# Altium project Temperature_controller.PrjPcb
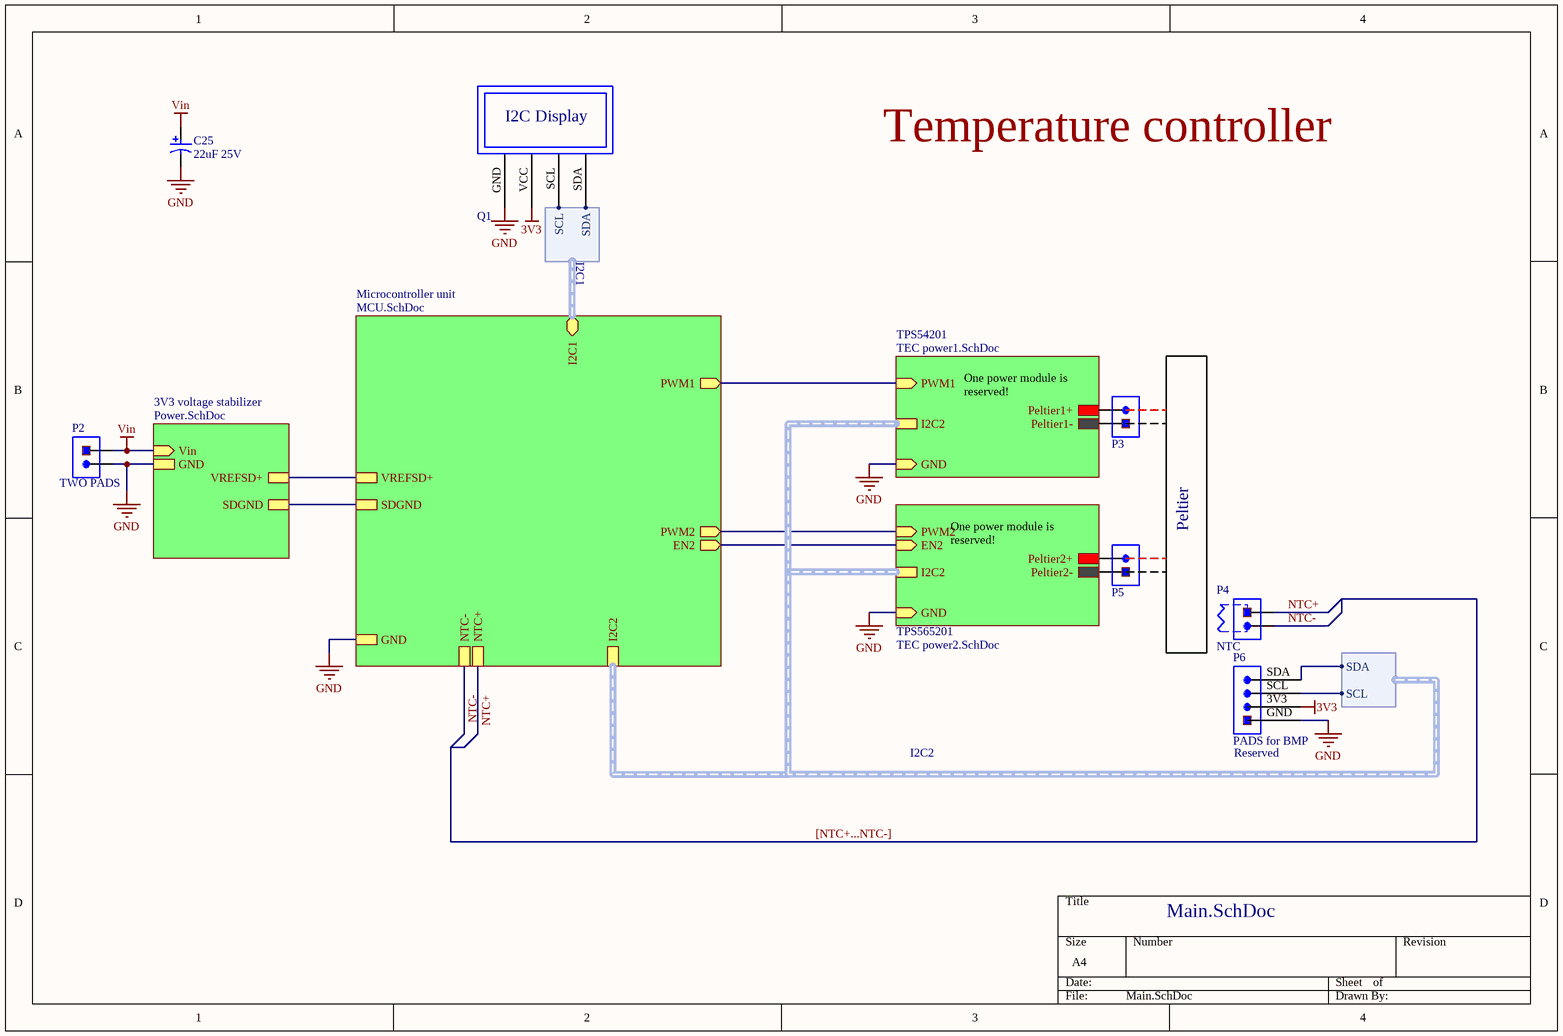
[diagram p0: Main.SchDoc]
5 sheets, 94 parts. Net scope: hierarchical (ports join the sheet entries above them; power ports are global).
Board file: temperature_controller.PcbDoc
Sheets:
  Main.SchDoc
    3V3 voltage stabilizer = Power.SchDoc
    Microcontroller unit = MCU.SchDoc
    TPS54201 = TEC power1.SchDoc
    TPS565201 = TEC power2.SchDoc

## Sheet Main.SchDoc
size A4

### Parts
C25  22uF 25V  [PNSC-FP-V-C_V]
P2  TWO PADS  [TWO PADS - medium]
P3  TWO PADS for TEC  [TWO PADS]  (value not drawn)
P4  NTC  [TWO PADS]
P5  TWO PADS for TEC  [TWO PADS]  (value not drawn)
P6  PADS for BMP  [FOUR PADS]
Q1  SSD1306 OLED_big  [SSD1306 OLED]  (value not drawn)

### Sub-sheets
3V3 voltage stabilizer = Power.SchDoc: Vin (in), VREFSD+, SDGND, GND
Microcontroller unit = MCU.SchDoc: I2C1 (bidir, harness I2C1), PWM1 (out), NTC+, NTC-, SDGND, VREFSD+, GND, I2C2 (harness I2C2), PWM2 (out), EN2 (out)
TPS54201 = TEC power1.SchDoc: PWM1 (in), Peltier1+, Peltier1-, GND (in), I2C2 (harness I2C2)
TPS565201 = TEC power2.SchDoc: PWM2 (in), EN2 (in), Peltier2+, Peltier2-, GND (in), I2C2 (harness I2C2)

### Harnesses
I2C1: SCL, SDA
I2C2: SDA, SCL

### Nets
3V3: P6.3V3 Q1.VCC
ADC_RES+: sheet 3V3 voltage stabilizer/VREFSD+, sheet Microcontroller unit/VREFSD+
GND: C25.2 P2.1 P5.2 P6.GND Q1.GND ; sheet 3V3 voltage stabilizer/GND, sheet Microcontroller unit/GND, sheet TPS54201/GND, sheet TPS565201/Peltier2-, sheet TPS565201/GND
NTC-: P4.1 ; sheet 3V3 voltage stabilizer/SDGND, sheet Microcontroller unit/NTC-, sheet Microcontroller unit/SDGND
Vin: C25.1 P2.2 ; sheet 3V3 voltage stabilizer/Vin
NTC+: P4.2 ; sheet Microcontroller unit/NTC+
TEC1_shunt-: P3.1 ; sheet TPS54201/Peltier1+
TEC2_shunt-: P5.1 ; sheet TPS565201/Peltier2+
NetC30_2: P3.2 ; sheet TPS54201/Peltier1-
NetIC1_5: sheet Microcontroller unit/PWM1, sheet TPS54201/PWM1
NetIC2_4: P6.SDA ; sheet Microcontroller unit/I2C2.SDA
NetIC2_5: P6.SCL ; sheet Microcontroller unit/I2C2.SCL
NetIC3_5: sheet Microcontroller unit/EN2, sheet TPS565201/EN2
NetQ1_SCL: Q1.SCL ; sheet Microcontroller unit/I2C1.SCL
NetQ1_SDA: Q1.SDA ; sheet Microcontroller unit/I2C1.SDA
NetR28_2: sheet Microcontroller unit/PWM2, sheet TPS565201/PWM2

### Buses and harness runs
bus [NTC+...NTC-]
harness sheet Microcontroller unit/I2C2 = sheet TPS54201/I2C2 = sheet TPS565201/I2C2

### Notes on the sheet
- Temperature controller
- One power module is reserved!
- Peltier
- (near P6) Reserved
- (in symbol SSD1306 OLED_big) I2C Display

### Library data of the parts
C25 = CMP-2000-06213-1: Aluminum Electrolytic Capacitor, 22 uF, +/- 20%, 25 V, 2-Pin SMD (Size Code C), -55 to 105 degC, RoHS, Tape and Reel; Manufacturer: Panasonic; ESR (Equivalent Series Resistance): 0.36O; Ripple Current: 240mA; Capacitance: 22µF; Lifetime@Temperature: 2000Hrs@105°C; Type: Can; Package Reference: FP-V-C; Package Description: 2-Pin Electrolytic Aluminum Capacitor, Body 5.3 x 5.3 mm; Operating Temp Range: -55to+105°C; Mounting Technology: SurfaceMount; Datasheet URL: http://industrial.panasonic.com/cdbs/www-data/pdf/RDE0000/ABA0000C1184.pdf; Case Size/Dimension: Ø5x5.8mm; Operating Temp-Max: 105°C; Package URL: http://industrial.panasonic.com/cdbs/www-data/pdf/RDE0000/DME0000COL48.pdf; Rated Voltage: 25V; Datasheet Version: 03/2016; Series: FP; Manufacturer URL: http://www.panasonic.com/; Value: 22uF; Voltage: 25V; LCSC Part #: C249771
P2 = TWO PADS: Value: 1uF
P3 P5 = TWO PADS for TEC: Value: 1uF
P4 = TWO PADS for NTC: Value: 1uF
P6 = PADS for BMP: Value: 1uF
Q1 = SSD1306 OLED_big: I2C display

## Sheet Power.SchDoc
size A4
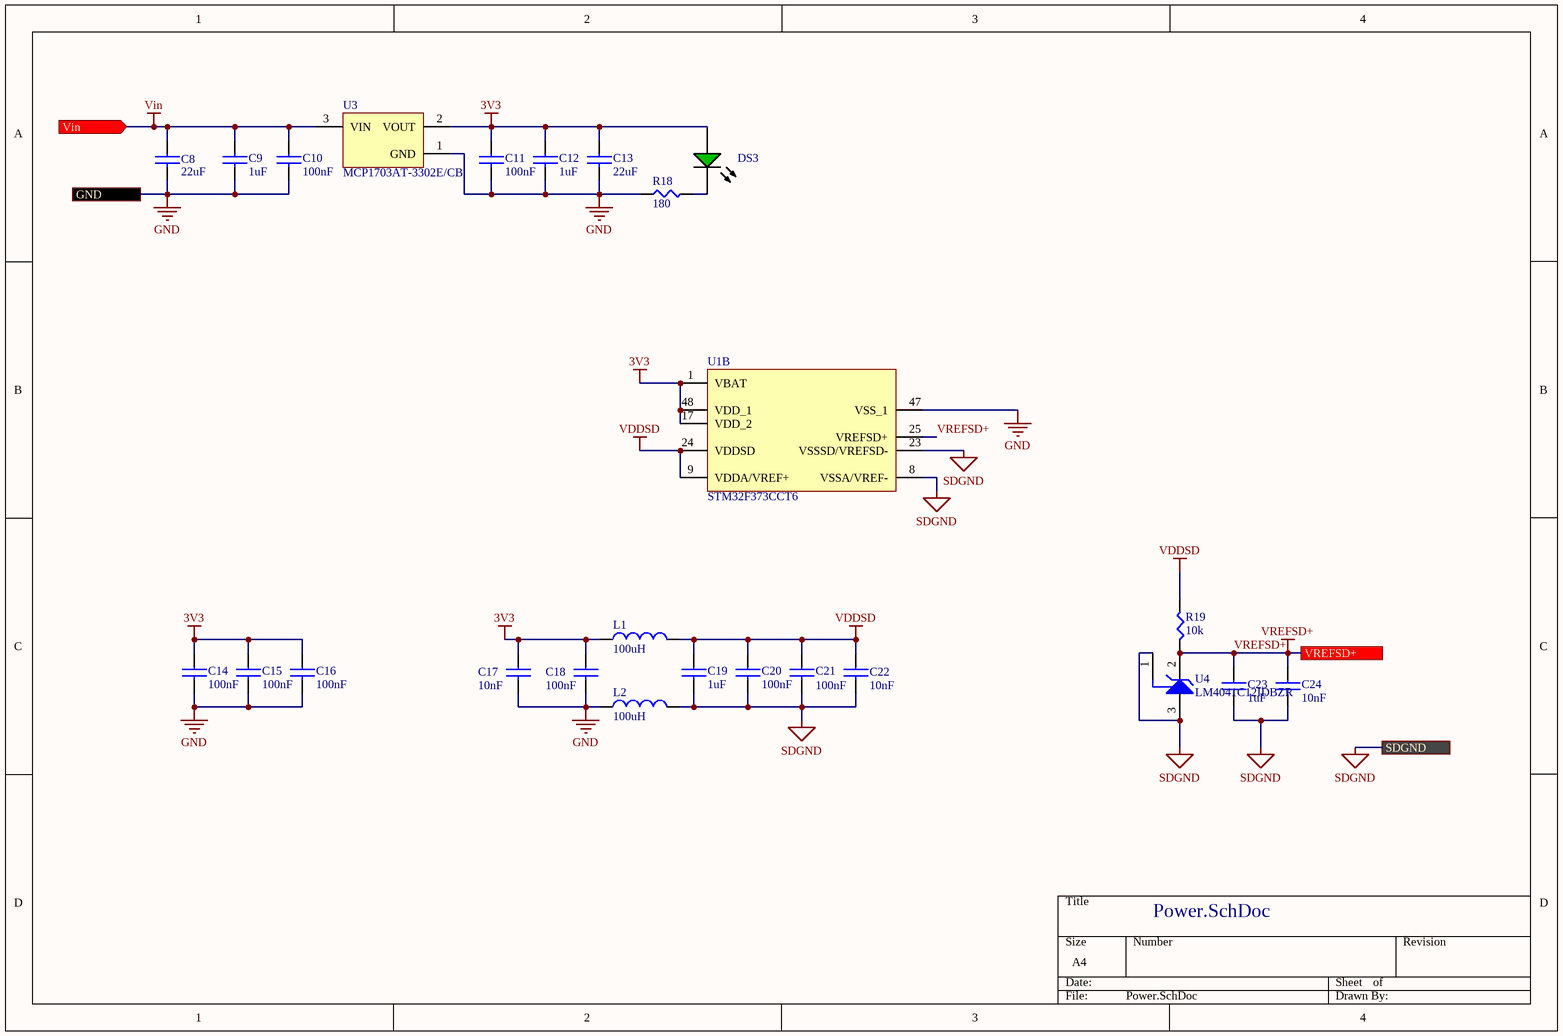
[diagram p1: Power.SchDoc]

### Parts
C8  22uF  [CAPC200X125X110L50N]
C9  1uF  [CAPC160X80X90L35N]
C10  100nF  [CAPC160X80X90L35N]
C11  100nF  [CAPC160X80X90L35N]
C12  1uF  [CAPC160X80X90L35N]
C13  22uF  [CAPC200X125X110L50N]
C14  100nF  [CAPC160X80X90L35N]
C15  100nF  [CAPC160X80X90L35N]
C16  100nF  [CAPC160X80X90L35N]
C17  10nF  [CAPC160X80X90L35N]
C18  100nF  [CAPC160X80X90L35N]
C19  1uF  [CAPC160X80X90L35N]
C20  100nF  [CAPC160X80X90L35N]
C21  100nF  [CAPC160X80X90L35N]
C22  10nF  [CAPC160X80X90L35N]
C23  1uF  [CAPC160X80X90L35N]
C24  10nF  [CAPC160X80X90L35N]
DS3  19-217/GHC-YR1S2/3T  [LEDC160X80X60L30N]  (value not drawn)
L1  100uH  [INDM320X250X240L55X190N]
L2  100uH  [INDM320X250X240L55X190N]
R18  180  [RESC160X80X90L30N]
R19  10k  [RESC160X80X90L30N]
U1  STM32F373CCT6  [STM-LQFP48_L]  (part B of 2)
U3  MCP1703AT-3302E/CB  [SOT-23A-CB3_M]
U4  LM4041C12IDBZR  [SOT-23A-CB3_M]

### Ports
GND, SDGND, Vin (in), VREFSD+

### Nets
3V3: C11.1 C12.1 C13.1 C14.1 C15.1 C16.1 C17.1 C18.1 DS3.A L1.1 U1.1(VBAT) U1.17(VDD_2) U1.48(VDD_1) U3.2(VOUT)
GND: C8.2 C9.2 C10.2 C11.2 C12.2 C13.2 C14.2 C15.2 C16.2 C17.2 C18.2 L2.1 R18.1 U1.47(VSS_1) U3.1(GND) ; port GND
SDGND: C19.2 C20.2 C21.2 C22.2 C23.2 C24.2 L2.2 U1.8(VSSA/VREF-) U1.23(VSSSD/VREFSD-) U4.1(CATHODE) U4.3(NC) ; port SDGND  [project net NTC-]
VDDSD: C19.1 C20.1 C21.1 C22.1 L1.2 R19.2 U1.9(VDDA/VREF+) U1.24(VDDSD)
Vin: C8.1 C9.1 C10.1 U3.3(VIN) ; port Vin
VREFSD+: C23.1 C24.1 R19.1 U1.25(VREFSD+) U4.2(ANODE) ; port VREFSD+  [project net ADC_RES+]
NetDS3_C: DS3.C R18.2

### Library data of the parts
C8 C13 = capacitor: Part Number: CL21A226MAQNNNE; Value: 22uF; LCSC Part #: C45783
C9 C12 C19 C23 = capacitor: Part Number: CL10A105KB8NNNC; Value: 1uF; LCSC Part #: C15849
C10 C11 C14-C16 C18 C20 C21 = capacitor: Part Number: CC0603KRX7R9BB104; Value: 100nF; LCSC Part #: C14663
C17 C22 C24 = capacitor: Part Number: 0603B103K500NT; Value: 10nF; LCSC Part #: C57112
DS3 = LED: Green LED; Part Number: 19-217/GHC-YR1S2/3T; LCSC Part #: C72043
L1 L2 = Inductor: Part Number: NLV32T-101J-PF; Value: 100uH; Resistance: *; Package: *; LCSC Part #: C76836
R18 = Resistor: Part Number: 0603WAF1800T5E; Value: 180; LCSC Part #: C22828
R19 = Resistor: Part Number: 0603WAF1002T5E; Value: 10k; LCSC Part #: C25804
U1 = STM32F373CCT6: ARM Cortex-M4 32-bit MCU, 256 KB Flash, 32 KB Internal RAM, 36 I/Os, 48-pin LQFP, -40 to 85 degC, Tray; Manufacturer: STMicroelectronics; FLASH Size (Prog) (kB): 256; Internal RAM Size (kB): 32; Operating Frequency(F) (Processor speed) (MHz): 72; I/Os (High Current): 36; Supply Voltage(Vcc) min (V): 2; Mounting Technology: Surface Mount; ComponentLink2Description: Datasheet; PackageReference: LQFP48; Packing: Tray; PackageVersion: Rev. 6, 06/2013; ComponentLink1Description: Manufacturer URL; ComponentLink3Description: Package Specification; ComponentLink2URL: http://www.st.com/st-web-ui/static/active/en/resource/technical/document/datasheet/DM00046749.pdf; PartNumber: STM32F373CCT6; Core: ARM Cortex-M4; ComponentLink1URL: http://www.st.com/web/en/home.html; ComponentLink3URL: http://www.st.com/st-web-ui/static/active/en/resource/technical/document/datasheet/DM00058181.pdf; DatasheetVersion: Rev. 3; PackageDescription: 48-Pin Low Profile Quad Flat Package, 7 x 7 mm Body, 0.5 mm Pitch; LCSC Part #: C89403; Manufacturer Part Number: STM32F373CCT6
U3 = CMP-0136-00758-1: PackageReference: SOT-23A-CB3; PackageVersion: revBB, Aug-2009; DatasheetVersion: revD, Sep-2009; PackageDescription: 3-Lead Plastic Small Outline Transistor (CB) [SOT-23A]; Part Number: MCP1703; LCSC Part #: C144183
U4 = LMZ4041C12IDBZR: Precision Micropower Shunt Voltage Reference, 0.5% accuracy, 1.2 V, 15 ppm / degC, 12 mA, -40 to 85 degC, 3-pin SOT-23 (DBZ), Green (RoHS & no Sb/Br); Manufacturer: Texas Instruments; Rating: Catalog; Temp Coeff(Max)(ppm/ degree C): 100; Min Iz for Regulation(uA): 60; Iout/Iz(Max)(mA): 12; Temp Coeff(Typ)(ppm/ degree C): 15; Initial Accuracy @ 25/deg C(%): 0.5; VO(V): 1.225; ComponentLink3URL: http://www.ti.com/litv/pdf/mpds108a; Code_JEDEC: TO-236; PackageVersion: 4203227/B; SubFamily: Shunt Voltage Reference; ComponentLink4Description: URL Link1; ComponentLink4URL: Samples URL:http://www.ti.com/product/lm4041c12; Mounting Technology: Surface Mount; ComponentLink1URL: http://www.ti.com/; ComponentLink2URL: http://www.ti.com/general/docs/lit/getliterature.tsp?genericPartNumber=LM4041C12&fileType=pdf; Eco-Plan: Green (RoHS & no Sb/Br); PackageReference: DBZ0003A; PackageDescription: 3-Pin Plastic Small Outline, Body 2.92 x 1.3 mm, Pitch 0.95 mm; PartNumber: LM4041C12IDBZR; DatasheetVersion: SLCS146E; ComponentLink2Description: Datasheet; ComponentLink1Description: Manufacturer URL; ComponentLink3Description: Package Specification; LCSC Part #: C133587

## Sheet MCU.SchDoc
size A4
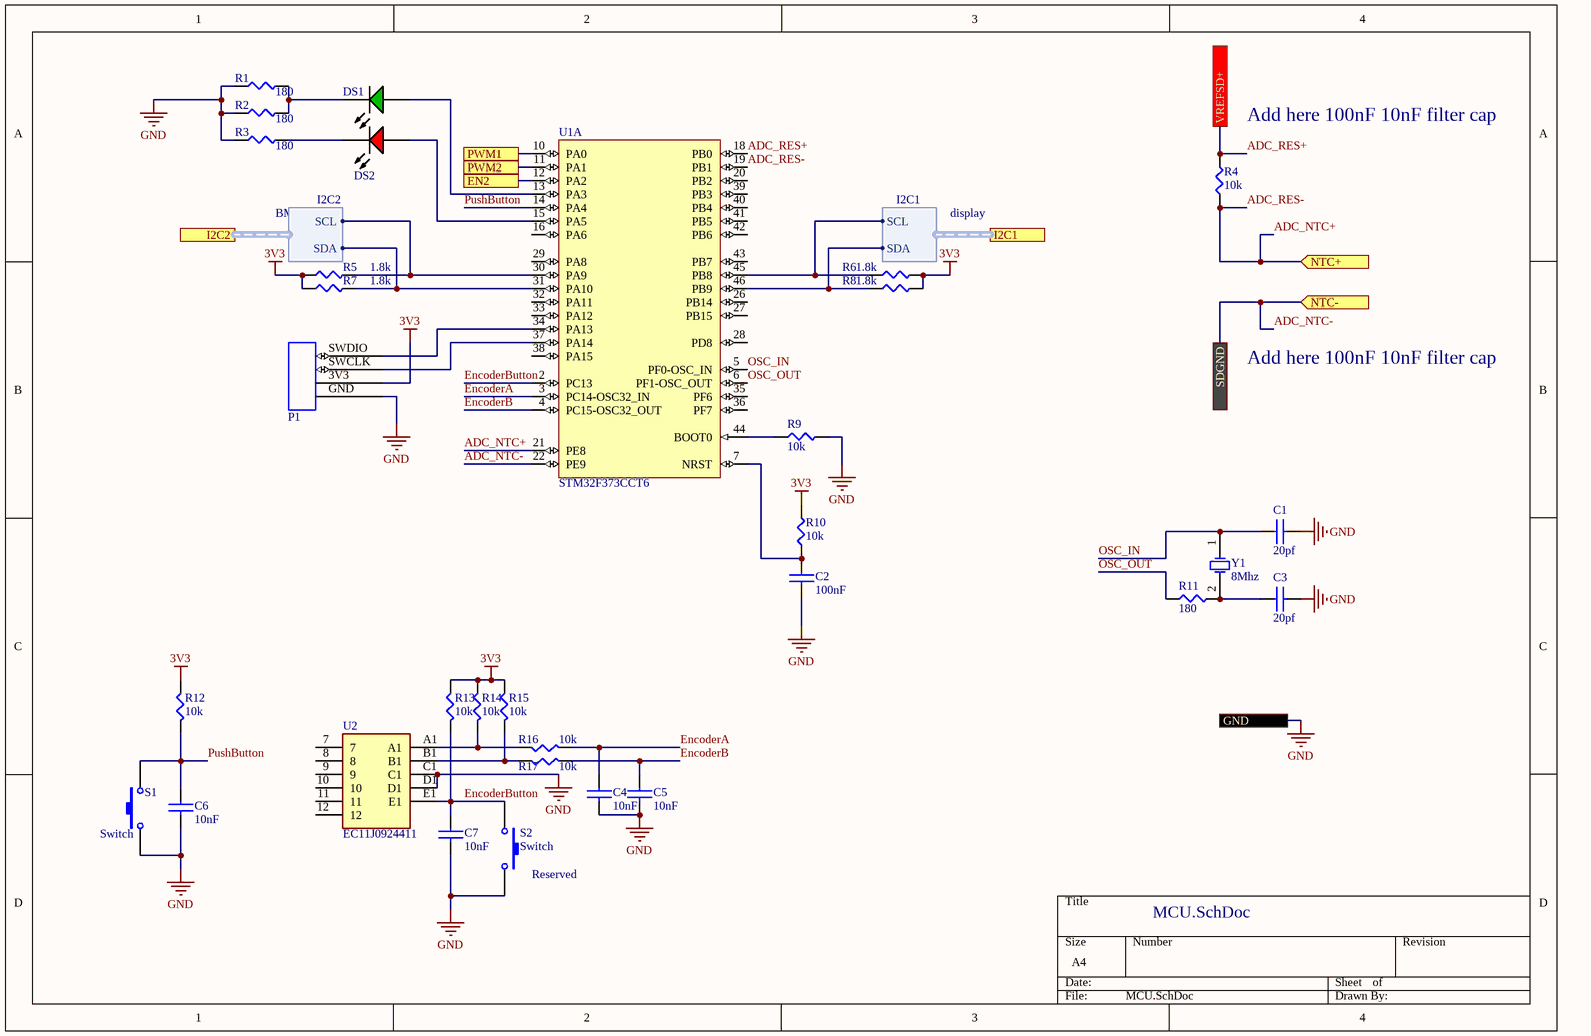
[diagram p2: MCU.SchDoc]

### Parts
C1  20pf  [CAPC160X80X90L35N]
C2  100nF  [CAPC160X80X90L35N]
C3  20pf  [CAPC160X80X90L35N]
C4  10nF  [CAPC160X80X90L35N]
C5  10nF  [CAPC160X80X90L35N]
C6  10nF  [CAPC160X80X90L35N]
C7  10nF  [CAPC160X80X90L35N]
DS1  19-217/GHC-YR1S2/3T  [LEDC160X80X60L30N]  (value not drawn)
DS2  FC-2012HRK-620D  [LEDC200X125X110L30N]  (value not drawn)
P1  SWD  [SWD]  (value not drawn)
R1  180  [RESC160X80X90L30N]
R2  180  [RESC160X80X90L30N]
R3  180  [RESC160X80X90L30N]
R4  10k  [RESC160X80X90L30N]
R5  1.8k  [RESC160X80X90L30N]
R6  1.8k  [RESC160X80X90L30N]
R7  1.8k  [RESC160X80X90L30N]
R8  1.8k  [RESC160X80X90L30N]
R9  10k  [RESC160X80X90L30N]
R10  10k  [RESC160X80X90L30N]
R11  180  [RESC160X80X90L30N]
R12  10k  [RESC160X80X90L30N]
R13  10k  [RESC160X80X90L30N]
R14  10k  [RESC160X80X90L30N]
R15  10k  [RESC160X80X90L30N]
R16  10k  [RESC160X80X90L30N]
R17  10k  [RESC160X80X90L30N]
S1  Switch  [Tactile switch]
S2  Switch  [Tactile switch]
U1  STM32F373CCT6  [STM-LQFP48_L]  (part A of 2)
U2  EC11J0924411  [EC11J0924411]
Y1  8Mhz  [5032]

### Ports
EN2, GND, I2C1 (harness I2C1), I2C2 (harness I2C2), NTC+ (in), NTC- (in), PWM1, PWM2, SDGND, VREFSD+

### Harnesses
I2C1: SCL, SDA
I2C2: SCL, SDA

### Nets
3V3: P1.3V3 R5.1 R6.2 R7.1 R8.2 R10.2 R12.1 R13.1 R14.1 R15.1
ADC_NTC-: U1.22(PE9) ; port NTC-, port SDGND  [project net NTC-]
ADC_RES+: R4.2 U1.18(PB0) ; port VREFSD+
GND: C1.2 C2.2 C3.2 C4.2 C5.2 C6.2 C7.2 P1.GND R1.1 R2.1 R3.1 R9.2 S1.1 S2.2 U2.C1 U2.D1 ; port GND
ADC_NTC+: R4.1 U1.19(PB1) U1.21(PE8) ; port NTC+  [also labelled ADC_RES-]  [project net NTC+]
EncoderA: C4.1 R16.2 U1.3(PC14-OSC32_IN)
EncoderB: C5.1 R17.2 U1.4(PC15-OSC32_OUT)
EncoderButton: C7.1 R13.2 S2.1 U1.2(PC13) U2.E1
OSC_IN: C1.1 U1.5(PF0-OSC_IN) Y1.1(OSC1)
OSC_OUT: R11.1 U1.6(PF1-OSC_OUT)
PushButton: C6.1 R12.2 S1.2 U1.14(PA4)
NetC2_1: C2.1 R10.1 U1.7(NRST)
NetC3_1: C3.1 R11.2 Y1.2(OSC2)
NetDS1_A: DS1.A U1.13(PA3)
NetDS1_C: DS1.C R1.2 R2.2
NetDS2_A: DS2.A U1.15(PA5)
NetDS2_C: DS2.C R3.2
NetIC1_5: U1.10(PA0) ; port PWM1
NetIC2_4: R7.2 U1.31(PA10) ; port I2C2.SDA
NetIC2_5: R5.2 U1.30(PA9) ; port I2C2.SCL
NetIC3_5: U1.12(PA2) ; port EN2
NetP1_SWCLK: P1.SWCLK U1.37(PA14)
NetP1_SWDIO: P1.SWDIO U1.34(PA13)
NetQ1_SCL: R6.1 U1.45(PB8) ; port I2C1.SCL
NetQ1_SDA: R8.1 U1.46(PB9) ; port I2C1.SDA
NetR9_1: R9.1 U1.44(BOOT0)
NetR14_2: R14.2 R16.1 U2.A1
NetR15_2: R15.2 R17.1 U2.B1
NetR28_2: U1.11(PA1) ; port PWM2

Not connected (* = marked no-connect by the designer): U1 16(PA6) 20(PB2) 26(PB14) 27(PB15) 28(PD8) 29(PA8) 32(PA11) 33(PA12) 35(PF6) 36(PF7) 38(PA15) 39(PB3) 40(PB4) 41(PB5) 42(PB6) 43(PB7); U2 7 8 9 10 11 12

### Notes on the sheet
- (near R4) Add here 100nF 10nF filter cap
- BMP280
- display
- Add here 100nF 10nF filter cap
- (near S2) Reserved

### Library data of the parts
C1 C3 = capacitor: Part Number: CL10C200JB8NNNC; Value: 20pf; LCSC Part #: C1648
C2 = capacitor: Part Number: CC0603KRX7R9BB104; Value: 100nF; LCSC Part #: C14663
C4-C7 = capacitor: Part Number: 0603B103K500NT; Value: 10nF; LCSC Part #: C57112
DS1 = LED: Green LED; Part Number: 19-217/GHC-YR1S2/3T; LCSC Part #: C72043
DS2 = RED LED: Part Number: FC-2012HRK-620D; LCSC Part #: C84256; Package: 0805
P1 = SWD port
R1-R3 R11 = Resistor: Part Number: 0603WAF1800T5E; Value: 180; LCSC Part #: C22828
R4 R9 R10 R12-R17 = Resistor: Part Number: 0603WAF1002T5E; Value: 10k; LCSC Part #: C25804
R5-R8 = Resistor: Part Number: 0603WAF1801T5E; Value: 1.8k; LCSC Part #: C4177
S1 S2 = Switch: Part Number: TS-1187A-C-E-B; C57112: C318887; Published: 24-Mar-1999; LatestRevisionDate: 17-Jul-2002; LatestRevisionNote: Re-released for DXP Platform.; PackageReference: SPST-2; Publisher: Altium Limited; PackageDescription: Switch; 2 Leads
U1 = STM32F373CCT6: as U1 on sheet Power; Mounting Technology: Surface Mount; ComponentLink2Description: Datasheet; PackageReference: LQFP48; Packing: Tray; PackageVersion: Rev. 6, 06/2013; ComponentLink1Description: Manufacturer URL; ComponentLink3Description: Package Specification; ComponentLink2URL: http://www.st.com/st-web-ui/static/active/en/resource/technical/document/datasheet/DM00046749.pdf; PartNumber: STM32F373CCT6; Core: ARM Cortex-M4; ComponentLink1URL: http://www.st.com/web/en/home.html; ComponentLink3URL: http://www.st.com/st-web-ui/static/active/en/resource/technical/document/datasheet/DM00058181.pdf; DatasheetVersion: Rev. 3; PackageDescription: 48-Pin Low Profile Quad Flat Package, 7 x 7 mm Body, 0.5 mm Pitch; LCSC Part #: C89403; Manufacturer Part Number: STM32F373CCT6
U2 = EC11J0924411: Rotary encoder; Manufacturer_Name: ALPS; Datasheet Link: https://componentsearchengine.com//EC11J0924411.pdf; Height: 24.5mm; Mouser2 Part Number: 688-EC11J0924411; Mouser2 Price/Stock: https://www.mouser.com/Search/Refine.aspx?Keyword=688-EC11J0924411; Manufacturer_Part_Number: EC11J0924411
Y1 = XTAL: Crystal Oscillator; Part Number: X50328MSB2GI; Published: 8-Jun-2000; LatestRevisionDate: 17-Jul-2002; LatestRevisionNote: Re-released for DXP Platform.; PackageReference: R38; Publisher: Altium Limited; PackageDescription: Crystal, Thru-Hole; 2 Leads; Body 3.1 x 8.2 mm (Dia.xH); Value: 8Mhz; LCSC Part #: C115962

## Sheet TEC power1.SchDoc
size A4
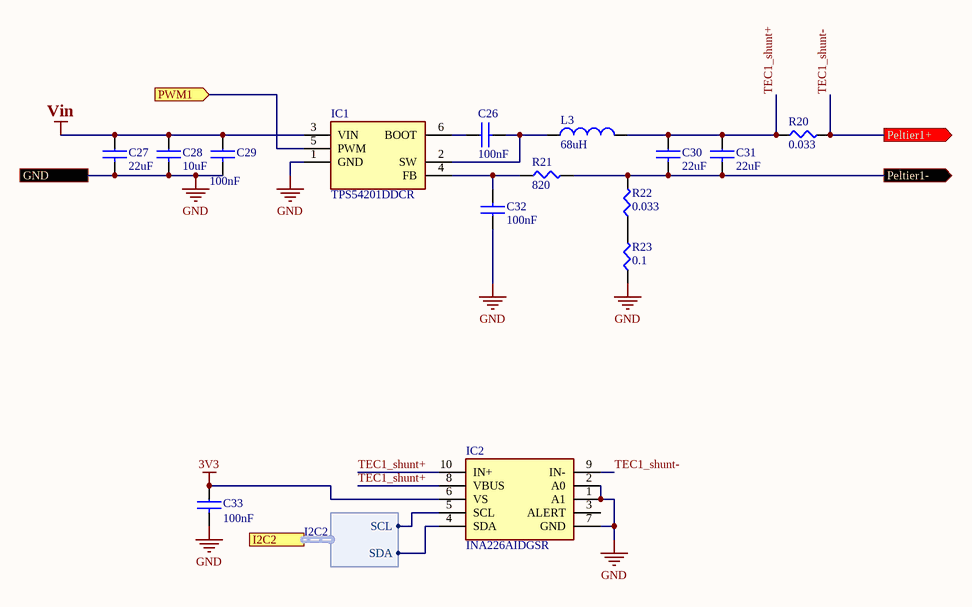
[diagram p3: TEC power1.SchDoc]

### Parts
C26  100nF  [CAPC160X80X90L35N]
C27  22uF  [CAPC200X125X110L50N]
C28  10uF  [CAPC200X125X110L50N]
C29  100nF  [CAPC160X80X90L35N]
C30  22uF  [CAPC200X125X110L50N]
C31  22uF  [CAPC200X125X110L50N]
C32  100nF  [CAPC160X80X90L35N]
C33  100nF  [CAPC160X80X90L35N]
IC1  TPS54201DDCR  [SOT95P280X110-6N]
IC2  INA226AIDGSR  [SOP10P50_300X490X110L55X22N]
L3  68uH  [INDM1250X1250X800L290X540N]
R20  0.033  [RESC200X125X70L40N]
R21  820  [RESC160X80X90L30N]
R22  0.033  [RESC200X125X70L40N]
R23  0.1  [RESC310X152X65L45N]

### Ports
GND, I2C2 (harness I2C2), Peltier1+ (out), Peltier1- (out), PWM1 (in)

### Harnesses
I2C2: SCL, SDA

### Nets
3V3: C33.1 IC2.6(VS)
GND: C27.2 C28.2 C29.2 C32.1 C33.2 IC1.1(GND) IC2.1(A1) IC2.2(A0) IC2.7(GND) R23.1 ; port GND
Vin: C27.1 C28.1 C29.1 IC1.3(VIN)
TEC1_shunt+: C30.1 C31.1 IC2.8(VBUS) IC2.10(IN+) L3.2 R20.1
TEC1_shunt-: IC2.9(IN-) R20.2 ; port Peltier1+
NetC26_1: C26.1 IC1.6(BOOT)
NetC26_2: C26.2 IC1.2(SW) L3.1
NetC30_2: C30.2 C31.2 R21.2 R22.2 ; port Peltier1-
NetC32_2: C32.2 IC1.4(FB) R21.1
NetIC1_5: IC1.5(PWM) ; port PWM1
NetIC2_4: IC2.4(SDA) ; port I2C2.SDA
NetIC2_5: IC2.5(SCL) ; port I2C2.SCL
NetR22_1: R22.1 R23.2

Not connected (* = marked no-connect by the designer): IC2 3(ALERT)

### Library data of the parts
C26 C29 C32 C33 = capacitor: Part Number: CC0603KRX7R9BB104; Value: 100nF; LCSC Part #: C14663
C27 C30 C31 = capacitor: Part Number: CL21A226MAQNNNE; Value: 22uF; LCSC Part #: C45783
C28 = capacitor: Part Number: CL21A106KAYNNNE; Value: 10uF; LCSC Part #: C15850
IC1 = TPS54201DDCR_1: Integrated Circuit; Manufacturer_Name: Texas Instruments; Datasheet Link: http://www.ti.com/lit/gpn/TPS54201; Height: 1.1mm; Mouser2 Part Number: 595-TPS54201DDCR; Mouser2 Price/Stock: https://www.mouser.com/Search/Refine.aspx?Keyword=595-TPS54201DDCR; Manufacturer_Part_Number: TPS54201DDCR; Part Number: TPS54201; Parameter 1: *
IC2 = INA226AIDGSR: Integrated Circuit; Manufacturer_Name: Texas Instruments; Datasheet Link: https://componentsearchengine.com/Datasheets/1/INA226AIDGSR.pdf; Height: 1.1mm; Mouser2 Part Number: 595-INA226AIDGSR; Mouser2 Price/Stock: https://www.mouser.com/Search/Refine.aspx?Keyword=595-INA226AIDGSR; Manufacturer_Part_Number: INA226AIDGSR; LCSC Part #: C49851
L3 = Inductor: Part Number: SWRB1207S-680MT; Resistance: 0.14; Value: 68uH; Package: *; LCSC Part #: C169377
R20 = Resistor: Megjegyzes: Eredetileg ez egy: 0805, 0.05ohm, 0805W8F500MT5E; Value: 0.033; LCSC Part #: C127689; Package: Package0805
R21 = Resistor: Part Number: 0603WAF8200T5E; Value: 820; LCSC Part #: C23253
R22 = Resistor: Part Number: 0805W8F330MT5E; Value: 0.033; LCSC Part #: C127689; Package: 0805
R23 = Resistor: Part Number: 1206W4F100LT5E; Value: 0.1; LCSC Part #: C25334; Package: 1206

## Sheet TEC power2.SchDoc
size A4
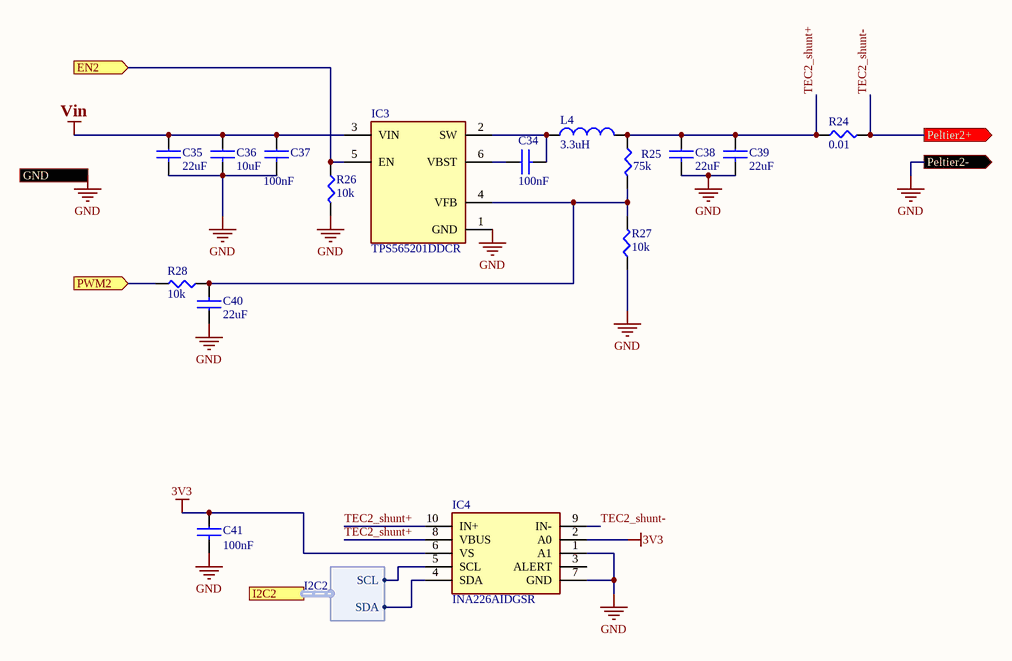
[diagram p4: TEC power2.SchDoc]

### Parts
C34  100nF  [CAPC160X80X90L35N]
C35  22uF  [CAPC200X125X110L50N]
C36  10uF  [CAPC200X125X110L50N]
C37  100nF  [CAPC160X80X90L35N]
C38  22uF  [CAPC200X125X110L50N]
C39  22uF  [CAPC200X125X110L50N]
C40  22uF  [CAPC200X125X110L50N]
C41  100nF  [CAPC160X80X90L35N]
IC3  TPS565201DDCR  [SOT95P280X110-6N]
IC4  INA226AIDGSR  [SOP10P50_300X490X110L55X22N]
L4  3.3uH  [INDM730X660X300L160X290N]
R24  0.01  [RESC200X125X70L40N]
R25  75k  [RESC160X80X90L30N]
R26  10k  [RESC160X80X90L30N]
R27  10k  [RESC160X80X90L30N]
R28  10k  [RESC160X80X90L30N]

### Ports
EN2 (in), GND, I2C2 (harness I2C2), Peltier2+ (out), Peltier2- (out), PWM2 (in)

### Harnesses
I2C2: SCL, SDA

### Nets
3V3: C41.1 IC4.2(A0) IC4.6(VS)
GND: C35.2 C36.2 C37.2 C38.2 C39.2 C40.1 C41.2 IC3.1(GND) IC4.1(A1) IC4.7(GND) R26.2 R27.1 ; port Peltier2-, port GND
Vin: C35.1 C36.1 C37.1 IC3.3(VIN)
TEC2_shunt+: C38.1 C39.1 IC4.8(VBUS) IC4.10(IN+) L4.2 R24.1 R25.1
TEC2_shunt-: IC4.9(IN-) R24.2 ; port Peltier2+
NetC34_1: C34.1 IC3.6(VBST)
NetC34_2: C34.2 IC3.2(SW) L4.1
NetC40_2: C40.2 IC3.4(VFB) R25.2 R27.2 R28.1
NetIC2_4: IC4.4(SDA) ; port I2C2.SDA
NetIC2_5: IC4.5(SCL) ; port I2C2.SCL
NetIC3_5: IC3.5(EN) R26.1 ; port EN2
NetR28_2: R28.2 ; port PWM2

Not connected (* = marked no-connect by the designer): IC4 3(ALERT)

### Library data of the parts
C34 C37 C41 = capacitor: Part Number: CC0603KRX7R9BB104; Value: 100nF; LCSC Part #: C14663
C35 C38-C40 = capacitor: Part Number: CL21A226MAQNNNE; Value: 22uF; LCSC Part #: C45783
C36 = capacitor: Part Number: CL21A106KAYNNNE; Value: 10uF; LCSC Part #: C15850
IC3 = TPS565201DDCR: Integrated Circuit; Manufacturer_Name: Texas Instruments; Datasheet Link: http://www.ti.com/lit/gpn/tps565201; Height: 1.1mm; Manufacturer_Part_Number: TPS565201DDCR
IC4 = INA226AIDGSR: as IC2 on sheet TEC power1; Datasheet Link: https://componentsearchengine.com/Datasheets/1/INA226AIDGSR.pdf; Height: 1.1mm; Mouser2 Part Number: 595-INA226AIDGSR; Mouser2 Price/Stock: https://www.mouser.com/Search/Refine.aspx?Keyword=595-INA226AIDGSR; Manufacturer_Part_Number: INA226AIDGSR; LCSC Part #: C49851
L4 = Inductor: Part Number: MHCI06030-3R3M-R8A; Resistance: 22mOhm; Value: 3.3uH; Package: *; LCSC Part #: C280586
R24 = Resistor: Part Number: 1206W4F100MT5E; Alternatives: 0805W4F100MT5E, 1206W4F100MT5E; Megjegyzes: Eredetileg ez egy: 1206, 0.01ohm, 1206W4F100MT5E; Value: 0.01; LCSC Part #: C127689; Package: 1206
R25 = Resistor: Part Number: 0603WAF7502T5E; Value: 75k; LCSC Part #: C46216; Package: 0805
R26-R28 = Resistor: Part Number: 0603WAF1002T5E; Value: 10k; LCSC Part #: C25804; Package: 0603

## Nets that join several sheets
3V3: Main (P6.3V3 Q1.VCC), Power (14 pins), MCU (10 pins), TEC power1 (C33.1 IC2.6), TEC power2 (C41.1 IC4.2 IC4.6)
ADC_RES+: Power (5 pins), MCU (R4.2 U1.18)
GND: Main (5 pins), Power (15 pins), MCU (16 pins), TEC power1 (10 pins), TEC power2 (12 pins)
NTC-: Main (P4.1), Power (11 pins), MCU (U1.22)
Vin: Main (C25.1 P2.2), Power (C8.1 C9.1 C10.1 U3.3), TEC power1 (C27.1 C28.1 C29.1 IC1.3), TEC power2 (C35.1 C36.1 C37.1 IC3.3)
NetC30_2: Main (P3.2), TEC power1 (C30.2 C31.2 R21.2 R22.2)
NetIC1_5: MCU (U1.10), TEC power1 (IC1.5)
NetIC2_4: Main (P6.SDA), MCU (R7.2 U1.31), TEC power1 (IC2.4), TEC power2 (IC4.4)
NetIC2_5: Main (P6.SCL), MCU (R5.2 U1.30), TEC power1 (IC2.5), TEC power2 (IC4.5)
NetIC3_5: MCU (U1.12), TEC power2 (IC3.5 R26.1)
NetQ1_SCL: Main (Q1.SCL), MCU (R6.1 U1.45)
NetQ1_SDA: Main (Q1.SDA), MCU (R8.1 U1.46)
NetR28_2: MCU (U1.11), TEC power2 (R28.2)
NTC+: Main (P4.2), MCU (R4.1 U1.19 U1.21)
TEC1_shunt-: Main (P3.1), TEC power1 (IC2.9 R20.2)
TEC2_shunt-: Main (P5.1), TEC power2 (IC4.9 R24.2)